# Altium schematic sheet POWER.SchDoc: POWER
size B; SheetNumber: 7; SheetTotal: 9
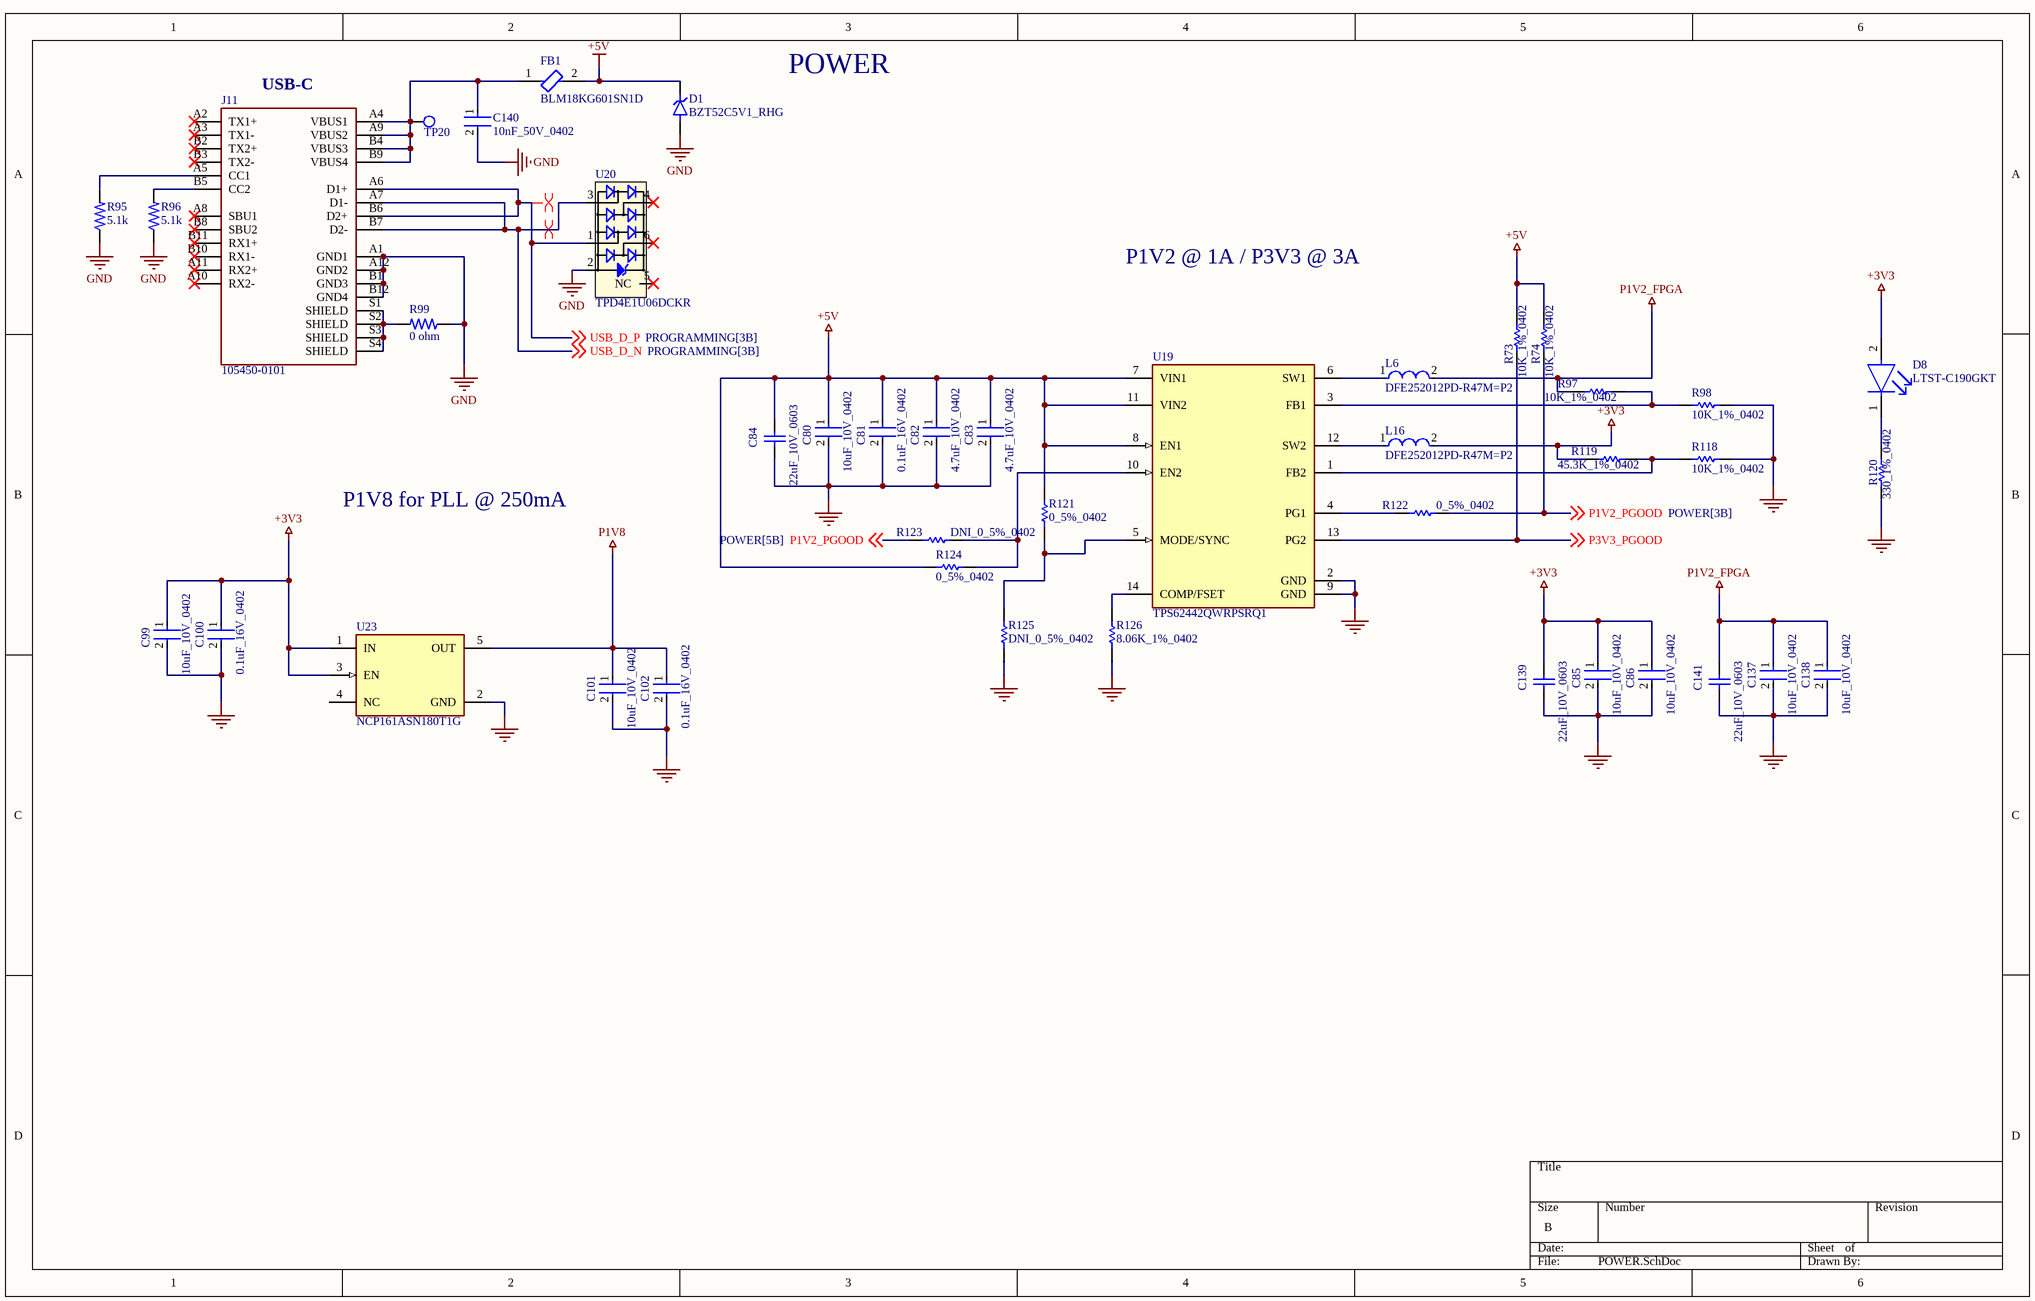
[diagram p0: POWER.SchDoc]

## Parts
C80  10uF_10V_0402  [FP-CL05A106MP5NUNC-MFG]
C81  0.1uF_16V_0402  [FP-C0402-BB-MFG]
C82  4.7uF_10V_0402  [FP-C1005-050-0_15-MFG]
C83  4.7uF_10V_0402  [FP-C1005-050-0_15-MFG]
C84  22uF_10V_0603  [CAPC1608X100X20ML10]
C85  10uF_10V_0402  [FP-CL05A106MP5NUNC-MFG]
C86  10uF_10V_0402  [FP-CL05A106MP5NUNC-MFG]
C99  10uF_10V_0402  [FP-CL05A106MP5NUNC-MFG]
C100  0.1uF_16V_0402  [FP-C0402-BB-MFG]
C101  10uF_10V_0402  [FP-CL05A106MP5NUNC-MFG]
C102  0.1uF_16V_0402  [FP-C0402-BB-MFG]
C137  10uF_10V_0402  [FP-CL05A106MP5NUNC-MFG]
C138  10uF_10V_0402  [FP-CL05A106MP5NUNC-MFG]
C139  22uF_10V_0603  [CAPC1608X100X20ML10]
C140  10nF_50V_0402  [FP-CL165-IPC_C]
C141  22uF_10V_0603  [CAPC1608X100X20ML10]
D1  BZT52C5V1_RHG  [D_BZT52C5V1_RHG]
D8  LTST-C190GKT  [FP-LTST-C190GKT-MFG]
FB1  BLM18KG601SN1D  [FP-BLM18-0_15-t0_8-IPC_A]
J11  105450-0101  [CONN_105450-0101]
L6  DFE252012PD-R47M=P2  [FP-DFE252012C-IPC_A]
L16  DFE252012PD-R47M=P2  [FP-DFE252012C-IPC_A]
R73  10K_1%_0402  [RESC1005X40X25NL10T10]
R74  10K_1%_0402  [RESC1005X40X25NL10T10]
R95  5.1k  [RES_0402]
R96  5.1k  [RES_0402]
R97  10K_1%_0402  [RESC1005X40X25NL10T10]
R98  10K_1%_0402  [RESC1005X40X25NL10T10]
R99  0 ohm  [RES_0402]
R118  10K_1%_0402  [RESC1005X40X25NL10T10]
R119  45.3K_1%_0402  [RESC0402(1005)_L]
R120  330_1%_0402  [RESC1005X40X25NL10T10]
R121  0_5%_0402  [RESC1005X40X25NL05T10]
R122  0_5%_0402  [RESC1005X40X25NL05T10]
R123  DNI_0_5%_0402  [RESC1005X40X25NL05T10]  (no BOM)
R124  0_5%_0402  [RESC1005X40X25NL05T10]
R125  DNI_0_5%_0402  [RESC1005X40X25NL05T10]  (no BOM)
R126  8.06K_1%_0402  [RESC1005X40X25ML05T05]
TP20  Test Point 1MM  [TP_PAD-1MM]  (value not drawn)  (no BOM)
U19  TPS62442QWRPSRQ1  [FP-RQR0014A-MFG]
U20  TPD4E1U06DCKR  [IC_TPD4E1U06DCKR]
U23  NCP161ASN180T1G  [FP-527AH-MFG]

## Nets
+3V3: C85.1 C86.1 C99.1 C100.1 C139.2 D8.2(A) L16.2 R119.1 U23.1(IN) U23.3(EN)
+5V: C80.1 C81.1 C82.1 C83.1 C84.2 D1.C(K) FB1.2 R73.2 R74.2 R121.2 R124.2 U19.7(VIN1) U19.8(EN1) U19.11(VIN2)
GND: C80.2 C81.2 C82.2 C83.2 C84.1 C85.2 C86.2 C99.2 C100.2 C101.2 C102.2 C137.2 C138.2 C139.1 C140.2 C141.1 D1.A J11.A1(GND1) J11.A12(GND2) J11.B1(GND3) J11.B12(GND4) R95.1 R96.1 R98.1 R99.1 R118.1 R120.1 R125.1 R126.1 U19.2(GND) U19.9(GND) U20.2(GND) U23.2(GND)
P1V2_FPGA: C137.1 C138.1 C141.2 L6.2 R97.2
P1V8: C101.1 C102.1 U23.5(OUT)
P1V2_PGOOD: R74.1 R122.2 R123.1 ; off-sheet P1V2_PGOOD
P3V3_PGOOD: R73.1 U19.13(PG2) ; off-sheet P3V3_PGOOD
USB_D_N: J11.A7(D1-) J11.B7(D2-) U20.3(D+) ; off-sheet USB_D_N
USB_D_P: J11.A6(D1+) J11.B6(D2+) U20.1(D+) ; off-sheet USB_D_P
NetC140_1: C140.1 FB1.1 J11.A4(VBUS1) J11.A9(VBUS2) J11.B4(VBUS3) J11.B9(VBUS4) TP20.1
NetD8_1: D8.1(C) R120.2
NetJ11_A5: J11.A5(CC1) R95.2
NetJ11_B5: J11.B5(CC2) R96.2
NetJ11_S1: J11.S1(SHIELD) J11.S2(SHIELD) J11.S3(SHIELD) J11.S4(SHIELD) R99.2
NetL6_1: L6.1 U19.6(SW1)
NetL16_1: L16.1 U19.12(SW2)
NetR97_1: R97.1 R98.2 U19.3(FB1)
NetR118_2: R118.2 R119.2 U19.1(FB2)
NetR121_1: R121.1 R125.2 U19.5(MODE/SYNC)
NetR122_1: R122.1 U19.4(PG1)
NetR123_2: R123.2 R124.1 U19.10(EN2)
NetR126_2: R126.2 U19.14(COMP/FSET)

Not connected (* = marked no-connect by the designer): J11 A2(TX1+)* A3(TX1-)* A8(SBU1)* A10(RX2-)* A11(RX2+)* B2(TX2+)* B3(TX2-)* B8(SBU2)* B10(RX1-)* B11(RX1+)*; U20 4(D-)* 5(NC)* 6(D-)*; U23 4(NC)

## Layout directives
differential pair: USB_D_N, USB_D_P

## Notes on the sheet
- (near J11) USB-C
- P1V2 @ 1A / P3V3 @ 3A
- P1V8 for PLL @ 250mA

## Library data of the parts
C80 C85 C86 C99 C101 C137 C138 = CMP-13271-000002-1: CAP CER 10UF 10V X5R 0402; Manufacturer Part Number: CL05A106MP5NUNC; Manufacturer: Samsung; Temperature Coefficient: 15%; Tolerance: 20%; Material: Ceramic; Octopart: https://octopart.com/cl05a106mp5nunc-samsung-22457395; Voltage Rating: 10V; RoHS: TRUE; Value: 10uF; Height: 0.7mm; Digikey Description: CAP CER 10UF 10V X5R 0402; Automotive: No; Package: CL05A106MP5NUNC; Device Class L1: Passive Components; Capacitance: 10uF; Temperature Range High: +85°C; ComponentLink2Description: Datasheet; Device Class L2: Capacitors; Temperature Characteristic: X5R; Temperature: -55°C to +85°C; ComponentLink2URL: http://www.samsungsem.com/kr/support/product-search/mlcc/__icsFiles/afieldfile/2019/05/10/19-CL05A106MP5NUNC.pdf; Device Class L3: Ceramic Capacitors; Category: Cap; Temperature Range Low: -55°C; Ipc Land Pattern Name: CAPC10050X50; Lead Free: Yes
C81 C100 C102 = CMP-1034-02068-3: CAP CER 0.1UF 16V 5% X7R 0402; Manufacturer: Kemet; Manufacturer Part Number: C0402C104J4RACTU; Value: 0.10 μF; Temperature Coefficient: 15%; Tolerance: 0.05; Material: Ceramic; ComponentLink2URL: https://content.kemet.com/datasheets/KEM_C1002_X7R_SMD.pdf; Automotive: No; Device Class L2: Capacitors; Temperature: -55°C to +125°C; RoHS: TRUE; Voltage Rating: 16 V; ComponentLink2Description: Datasheet; Device Class L3: Ceramic Capacitors; Temperature Range Low: -55°C; Ipc Land Pattern Name: CAPC10050X50; Device Class L1: Passive Components; Temperature Range High: +125°C; Package: C0402-BB; Capacitance: 0.10 μF; Category: Cap; Mouser Description: CAP CER 0.1UF 16V X7R 0402; Height: 0.55mm; Digikey Description: CAP CER 0.1UF 16V 5% X7R 0402; Octopart: https://octopart.com/c0402c104j4ractu-kemet-12573893; Temperature Characteristic: X7R; Lead Free: Yes
C82 C83 = CMP-2000-05997-2: CAP CER 4.7UF 10V X5R 0402; Dielectric Material: Ceramic; Tolerance: 10%; Series: C; Package Quantity: 10000; Max Operating Temperature: 85°C; Case Code (Imperial): 0402; Lead Free: Lead Free; Voltage Rating (DC): 10V; Packaging: Cut Tape; Voltage Rating: 10V; Min Operating Temperature: -55°C; Dielectric: X5R; Thickness: 0.022inch; Width: 0.02inch; Case/Package: 0402; Case Code (Metric): 1005; Capacitance: 4.7uF; Length: 0.039inch; RoHS Compliant: Yes; REACH SVHC: No SVHC; Mount: Surface Mount
C84 C139 C141 = CMP-2000-05441-1: Chip Capacitor, 22 uF, +/- 20%, 10 V, -55 to 85 degC, 0603 (1608 Metric), RoHS, Tape and Reel; Manufacturer: TDK; PCN Part Number: MLCCPartNumberChange30/Nov/2012; Voltage - Rated: 10V; Product Training Modules: CSeriesGeneralApplicationsSEAT,CCV,andTVCLDesignToolsGuidetoReplacinganElectrolyticCapacitorwithanMLCC; Other Names: 445-9077-1; Design Resources: 20WNon-IsolatedBuckLEDDriverUsingPLLNK460KG; Online Catalog: CSeries,GeneralPurpose; Capacitance: 22µF; Temperature Coefficient: X5R; Kits: 445-9014-KIT-ND-KITMLCC100PF-22UF060310-50V; Packaging: CutTape(CT); Standard Package: 1; Package / Case: 0603(1608Metric); Lead Style: -; Features: -; Ratings: -; Operating Temperature: -55degC~85degC; Applications: GeneralPurpose; Package Reference: 603; Datasheet URL: http://download.siliconexpert.com/pdfs/2015/4/21/15/54/45/779/tdk_/manual/37024850441143360mlcc_commercial_general_en.pdf; Datasheet Version: Mar-15; Mounting Type: SurfaceMount,MLCC; Lead Spacing: -; Size / Dimension: 0.063"Lx0.031"W(1.60mmx0.80mm); Height - Seated (Max): -; Package Description: 2-Pin Surface Mount Device, Body 1.6 x 0.8 mm; Manufacturer URL: http://www.tdk.com/; RoHS Information: RoHSCertificate-MLCC; Tolerance: ±20%; Series: C; Thickness (Max): 0.035"(0.90mm); Family: CeramicCapacitors; Category: Capacitors
C140 = CMP-13271-000387-1: Cap Ceramic 10nF 50V X7R ±10% SMD 0402 +125°C Paper T/R; Depth: 0.5mm; Length: 1mm; Lead Free: Lead Free; Case Code (Metric): 1005; Width: 0.02inch; Min Operating Temperature: -55°C; Thickness: 0.022inch; Package Quantity: 1; Mount: Surface Mount; Height: 0.5mm; Voltage: 50V; Material: Ceramic; Tolerance: 10%; Case Code (Imperial): 0402; Radiation Hardening: No; Case/Package: 0402; Max Operating Temperature: 125°C; Voltage Rating (DC): 50V; Contact Plating: Tin; Packaging: Tape and Reel; Voltage Rating: 50V; Capacitance: 10nF; Dielectric: X7R
D1 = D_BZT52C5V1_RHG: Vz=5.1V 4.8V~5.4V Izt=5mA; Manufacturer: Diodes; Manufacturer Part Number: BZT52C5V1-7-F; MP: BZT52C5V1 RHG; MF: Taiwan Semiconductor; Zener Voltage: 5.1V; Max Power Dissipation: 500mW; Impedance: 60R; Voltage Tolerance: 6%; Test Current: 5mA; Max Reverse Leakage Current: 2uA; Forward Voltage: 900mV; Output Current: 50mA; Availability: In Stock; SnapEDA_Link: https://www.snapeda.com/parts/BZT52C5V1%20RHG/Taiwan+Semiconductor/view-part/?ref=snap; Value: *; Price: None; Package: SOD-123F Taiwan Semiconductor; Purchase-URL: https://pricing.snapeda.com/search/part/BZT52C5V1 RHG/?ref=eda; Check_prices: https://www.snapeda.com/parts/BZT52C5V1%20RHG/Taiwan+Semiconductor/view-part/?ref=eda; Supplier 1: LCSC; RoHS: Yes; Category: Zener Diodes; Stock 1: 13380; Pricing 1: 20=0.0177, 200=0.0158, 600=0.0154, 3000=0.0137 (USD); Mounting Technology: Surface Mount; Pins: 2; Weight: 0.000353oz; Min Operating Temperature: -65°C; Max Operating Temperature: 150°C; Packaging: Tape and Reel; Package Quantity: 3000; Tolerance: 6%; Power Dissipation: 500mW; Series: -; Zener Current: 5mA; Power Rating: 500mW; Max Reverse Current: 2uA; Termination: SMD/SMT; Voltage Rating (DC): 5.1V; Working Voltage: 5.1V; Length: 2.85mm; Width: 1.7mm; Height: 1.35mm; Radiation Hardening: No; RoHS Compliant: Yes; Lead Free: Lead Free; Reach SVHC Compliant: No; ComponentLink1URL: https://datasheet.ciiva.com/15142/getdatasheetpartid-75143-15142417.pdf?src-supplier=Verical; ComponentLink1Description: https://datasheet.ciiva.com/15142/getdatasheetpartid-75143-15142417.pdf?src-supplier=Verical; ComponentLink2URL: https://datasheet.ciiva.com/4734/ds18004-73542-4734246.pdf?src-supplier=Mouser; ComponentLink2Description: https://datasheet.ciiva.com/4734/ds18004-73542-4734246.pdf?src-supplier=Mouser; ComponentLink3URL: https://datasheet.ciiva.com/22713/1670962-22713975.pdf?src-supplier=Element14; ComponentLink3Description: https://datasheet.ciiva.com/22713/1670962-22713975.pdf?src-supplier=Element14; Supplier Part Number 1: C151588
D8 = CMP-22017-000005-2: LED GREEN CLEAR CHIP SMD; Dominant Wavelength: 569nm; Reverse Voltage: 5V; Lens Color: Colorless; Viewing Angle: 130°; Voltage: 2V; Forward Current: 30mA; Power Dissipation: 100mW; Luminous Intensity: 6mcd; Number of LEDs: 1; Forward Voltage: 2.1V; Wavelength: 565nm; Test Current: 10mA; Min Operating Temperature: -55°C; Lens Style: Clear; Mount: Surface Mount; Width: 0.8mm; Packaging: Tape and Reel; Lens Transparency: Clear; Case Code (Metric): 1608; Depth: 0.8mm; Case Code (Imperial): 0603; Case/Package: 0603; Number of Pins: 2; Max Operating Temperature: 85°C; Lead Free: Lead Free; Number of Elements: 1; Length: 1.6mm; Height: 0.8mm; Package Quantity: 1; Power Rating: 100mW; Radiation Hardening: No; Illumination Color: Green; Color: Green
FB1 = CMP-0686-00581-3: Chip Ferrite Bead, 0603, 600Ω @ 100MHz, 0.15Ω, 25%, 1.3A; Material: Steel; Number of Lines: 1; Impedance: 600R; DC Resistance (DCR): 150mR; Tolerance: 25%; Case Code (Metric): 1608; Width: 0.8mm; DC Current: 1.3A; Max DC Current: 1.3A; Package Quantity: 1; Number of Pins: 2; Military Standard: Not; RoHS Compliant: Yes; Termination: SMD/SMT; Max Operating Temperature: 125°C; Length: 1.6mm; Depth: 0.8mm; Case Code (Imperial): 0603; Series: BLM18K; Inductor Type: FERRITE BEAD; Core Material: Ferrite; Number of Circuits: 1; Height: 0.8mm; Case/Package: 0603; REACH SVHC: No SVHC; Packaging: Tape and Reel; Min Operating Temperature: -55°C; Max Current Rating: 1.3A; Radiation Hardening: No; Current Rating: 1.3A; Lead Free: Lead Free; Test Frequency: 100MHz; Weight: 7.1E-05oz
J11 = CONN_105450-0101: USB-C (USB TYPE-C) USB 3.2 Gen 2 (USB 3.1 Gen 2, Superspeed + (USB 3.1)) Receptacle Connector 24 Position Surface Mount, Right Angle; Through Hole; MF: Molex; MP: 105450-0101; Availability: In Stock; Check_prices: https://www.snapeda.com/parts/105450-0101/Molex/view-part/?ref=eda; Price: None; SnapEDA_Link: https://www.snapeda.com/parts/105450-0101/Molex/view-part/?ref=snap; Purchase-URL: https://pricing.snapeda.com/search/part/105450-0101/?ref=eda; Package: None; Value: *
L6 L16 = CMP-06042-015149-1: Shielded Wirewound Inductor 0.47uH 20% 4000mA 0.027Ω 1008 (2520)
R73 R74 R97 R98 R118 = CMP-2002-04694-1: Manufacturer: Bourns; Part Number: CR0402-FX-1002GLF
R95 R96 = RES_RMCF0402FT5K10: Res Thick Film 0402 5.1K Ohm 1% 0.063W ±100ppm/°C Molded SMD Paper T/R; Manufacturer: Stackpole Electronics; Resistance: 5.1kR; Power Rating: 62.5mW; Max Power Dissipation: 63mW; Supplier 1: Digi-Key; Manufacturer Part Number: RMCF0402FT5K10; RoHS: Yes; Category: Chip SMD Resistors; Stock 1: 428257; Pricing 1: 1=0.10000, 10=0.01500, 100=0.00610, 1000=0.00274, 2500=0.00238, 5000=0.00197 (USD); Mount: Surface Mount; Case/Package: 0402; Case Code (Metric): 1005; Case Code (Imperial): 0402; Contact Plating: Tin,Matte; Min Operating Temperature: -55°C; Max Operating Temperature: 155°C; Packaging: Tape and Reel; Tolerance: 1%; Resistor Type: Thick Film; Number of Terminations: 2; Temperature Coefficient: 100ppm/°C; Features: Automotive AEC-Q200; Series: RMCF; Length: 0.039inch; Width: 0.02inch; Height: 0.016inch; Radiation Hardening: No; RoHS Compliant: Yes; ComponentLink1URL: http://components.arrow.com/part/dataview/51396875S385758N1174?src-supplier=Arrow+Electronics; ComponentLink1Description: http://components.arrow.com/part/dataview/51396875S385758N1174?src-supplier=Arrow+Electronics; ComponentLink2URL: https://www.seielect.com/catalog/SEI-RMCF_RMCP.pdf?src-supplier=Avnet; ComponentLink2Description: https://www.seielect.com/catalog/SEI-RMCF_RMCP.pdf?src-supplier=Avnet; ComponentLink3URL: https://www.seielect.com/catalog/SEI-Packaging.pdf?src-supplier=Digi-Key; ComponentLink3Description: https://www.seielect.com/catalog/SEI-Packaging.pdf?src-supplier=Digi-Key; ComponentLink4URL: https://www.seielect.com/catalog/SEI-RMCF_RMCP.pdf?src-supplier=Avnet+Asia; ComponentLink4Description: https://www.seielect.com/catalog/SEI-RMCF_RMCP.pdf?src-supplier=Avnet+Asia; Supplier Part Number 1: RMCF0402FT5K10CT-ND
R99 = RES_RC0402JR-070RL: RES SMD 0 OHM JUMPER 1/16W 0402; Manufacturer: Yageo; Value: 0mR; Power Rating: 62.5mW; Tolerance: 5%; Voltage Rating: 50V; Max Power Dissipation: 63mW; Temperature Coefficient: 200ppm/°C; Supplier 1: Digi-Key; Manufacturer Part Number: RC0402JR-070RL; RoHS: Yes; Category: Chip SMD Resistors; Stock 1: 33185339; Pricing 1: 1=0.10000, 10=0.01200, 25=0.00840, 50=0.00640, 100=0.00480, 250=0.00364, 500=0.00290, 1000=0.00214, 5000=0.00154 (USD); Case/Package: 0402; Case Code (Metric): 1005; Case Code (Imperial): 0402; Contact Plating: Tin,Matte; Min Operating Temperature: -55°C; Max Operating Temperature: 155°C; Package Quantity: 1; Packaging: Tape and Reel; Resistor Type: Thick Film; Number of Terminations: 2; Termination: SMD/SMT; Features: Moisture Resistant; Series: RC; Technology: THICK FILM; Resistance Tolerance: 5%; Construction: Rectangular; Length: 1mm; Width: 0.02inch; Height: 0.016inch; Depth: 0.5mm; Radiation Hardening: No; Military Standard: Not; Lead Free: Lead Free; RoHS Compliant: Yes; ComponentLink1URL: https://datasheet.ciiva.com/2452/pyu-rc0402-51-rohs-l-6-2452608.pdf?src-supplier=Digi-Key; ComponentLink1Description: https://datasheet.ciiva.com/2452/pyu-rc0402-51-rohs-l-6-2452608.pdf?src-supplier=Digi-Key; ComponentLink2URL: https://datasheet.ciiva.com/7983/1018594-7983535.pdf?src-supplier=Element14; ComponentLink2Description: https://datasheet.ciiva.com/7983/1018594-7983535.pdf?src-supplier=Element14; ComponentLink3URL: https://datasheet.ciiva.com/22747/1018594-22747515.pdf?src-supplier=Element14; ComponentLink3Description: https://datasheet.ciiva.com/22747/1018594-22747515.pdf?src-supplier=Element14; ComponentLink4URL: https://datasheet.ciiva.com/2452/pyu-r-int-thick-7-2452609.pdf?src-supplier=Digi-Key; ComponentLink4Description: https://datasheet.ciiva.com/2452/pyu-r-int-thick-7-2452609.pdf?src-supplier=Digi-Key; ComponentLink5URL: https://datasheet.ciiva.com/2452/pyu-r-int-thick-7-2452610.pdf?src-supplier=Digi-Key; ComponentLink5Description: https://datasheet.ciiva.com/2452/pyu-r-int-thick-7-2452610.pdf?src-supplier=Digi-Key; ComponentLink6URL: https://datasheet.ciiva.com/8896/pyu-rc0402-51-rohs-l-6-8896201.pdf?src-supplier=Avnet; ComponentLink6Description: https://datasheet.ciiva.com/8896/pyu-rc0402-51-rohs-l-6-8896201.pdf?src-supplier=Avnet; ComponentLink7URL: https://datasheet.ciiva.com/15189/getdatasheetpartid-326379-15189533.pdf?src-supplier=Verical; ComponentLink7Description: https://datasheet.ciiva.com/15189/getdatasheetpartid-326379-15189533.pdf?src-supplier=Verical; Supplier Part Number 1: 311-0.0JRCT-ND
R119 = CMP-1011-00697-1: 45K3 0.063W 1% 0402 (1005 Metric)  SMD; Case-EIA: 0402; Case-Metric: 1005; Value: 45300.00 Ohm; Technology: SMT; Tolerance: 1 %; Power: 0.063 W
R120 = CMP-2002-05853-1: Manufacturer: Panasonic; Part Number: ERA-2AED331X
R121-R125 = CMP-2002-06457-1: Manufacturer: Panasonic; Part Number: ERJ-U020R00X
R126 = CMP-2002-00253-3: Chip Resistor, 8.06 KOhm, +/- 1%, 63 mW, -55 to 155 degC, 0402 (1005 Metric), RoHS, Tape and Reel; PartNumber: CRCW04028K06FKED; Manufacturer: Basic Passives; Case\/Package: 0402; Power Rating: 63 mW; Voltage Rating: 50 V; PackageReference: 0402; Radiation Hardening: No; Package Quantity: 10000; Height: 0.35 mm; Packaging: Tape and Reel; Mount: Surface Mount; Length: 1 mm; Weight: 2.3E-05oz; Case Code (Metric): 1005; DatasheetVersion: 06/2012; Pins: 2; Min Operating Temperature: -55 degC; Case Code (Imperial): 0402; REACH SVHC: Unknown; Tolerance: 1%; Mounting Technology: Surface Mount; ComponentLink1URL: http://www.vishay.com/; ComponentLink2URL: http://www.vishay.com/docs/20035/dcrcwe3.pdf; ComponentLink2Description: Datasheet; Resistance: 8.06 KOhm; Max Operating Temperature: 155 degC; ComponentLink1Description: Manufacturer URL; Width: 0.5 mm; RoHSCompliant: true; PackageDescription: 2-Pin Surface Mount Device, Body 1 x 0.5 mm
TP20 = TP_PAD-1MM
U19 = CMP-04918-000654-1: Adjustable-Frequency Dual Step-Down Converter, 2.7-6V VIN, 0.6-5.5V 2A VOUT, VQFN-HR14
U20 = IC_TPD4E1U06DCKR: TVS DIODE 5.5VWM 15VC SC70-6; Manufacturer: Texas Instruments; Direction: Unidirectional; Value: 1pF; Operating Supply Voltage: 5.5V; Min Breakdown Voltage: 6.5V; Clamping Voltage: 11V; Peak Pulse Power: 45W; Power Line Protection: Yes; Number of Channels: 4; Test Current: 1mA; Max Reverse Leakage Current: 10nA; Peak Pulse Current: 3A; Interface: LVDS,USB,Ethernet; Supplier 1: LCSC; Manufacturer Part Number: TPD4E1U06DCKR; RoHS: Yes; Category: Integrated Circuits (ICs); Stock 1: 448671; Pricing 1: 1=0.1276, 10=0.0987, 30=0.0864, 100=0.0709, 500=0.064, 1000=0.0478 (USD); Mounting Technology: Surface Mount; Case/Package: SC; Pins: 6; Min Operating Temperature: -40°C; Max Operating Temperature: 125°C; Package Quantity: 3000; Packaging: Tape and Reel; Reverse Standoff Voltage: 5.5V; Breakdown Voltage: 6.5V; Termination: SMD/SMT; ESD Protection: Yes; Working Voltage: 5.5V; Max Power Dissipation: 45W; Series: -; Number of Unidirectional Channels: 4; Length: 2.15mm; Width: 1.4mm; Height: 1mm; Reach SVHC Compliant: No; Lead Free: Lead Free; RoHS Compliant: Yes; ComponentLink1URL: https://datasheet.ciiva.com/12545/tpd4e1u06-224689-12545136.pdf?src-supplier=Mouser; ComponentLink1Description: https://datasheet.ciiva.com/12545/tpd4e1u06-224689-12545136.pdf?src-supplier=Mouser; ComponentLink2URL: https://datasheet.ciiva.com/6574/tpd4e1u06-6574672.pdf?src-supplier=Digi-Key; ComponentLink2Description: https://datasheet.ciiva.com/6574/tpd4e1u06-6574672.pdf?src-supplier=Digi-Key; Supplier Part Number 1: C194628
U23 = CMP-00278-92192183-1: NCP161ASN180T1G LDO Regulator, 450 mA, Ultra-High PSRR, Ultra-Low Noise 1.8V, SOT23-5L, Active Discharge; Nominal Supply Current: 18µA; Output Type: Fixed; Number of Outputs: 1; Accuracy: 2%; Max Supply Voltage: 5.5V; Dropout Voltage: 365mV; Min Supply Voltage: 2.8V; Max Junction Temperature (Tj): 150°C; Output Current: 450mA; Output Voltage: 1.8V; Schedule B: 8542390000; Lifecycle Status: Production; NexarPartId: 92192183; Height: 1.45mm; Case/Package: SOT-23-5; RoHS: Compliant; Number of Channels: 1; Max Operating Temperature: 150°C; Manufacturer Lifecycle Status: ACTIVE